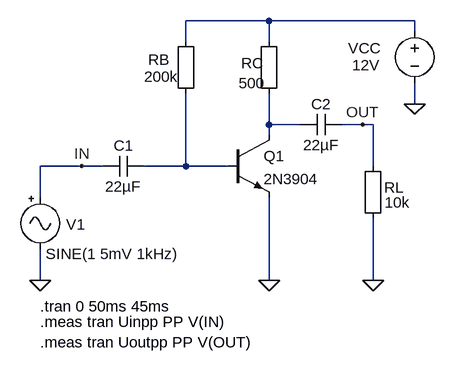
[diagram p0: schematic BT-CE-AMP-1.asc]
BT-CE-AMP-1.asc, the LTspice schematic file:
Version 4
SHEET 1 880 680
WIRE 192 -64 64 -64
WIRE 416 -64 192 -64
WIRE 416 -48 416 -64
WIRE 64 -32 64 -64
WIRE 192 -32 192 -64
WIRE 416 64 416 32
WIRE 192 96 192 48
WIRE 240 96 192 96
WIRE 336 96 304 96
WIRE 352 96 336 96
WIRE 192 112 192 96
WIRE -96 160 -160 160
WIRE -64 160 -96 160
WIRE 64 160 64 48
WIRE 64 160 0 160
WIRE 128 160 64 160
WIRE 352 160 352 96
WIRE -160 208 -160 160
WIRE -160 336 -160 288
WIRE 192 336 192 208
WIRE 352 336 352 240
FLAG 192 336 0
FLAG -160 336 0
FLAG 416 64 0
FLAG -96 160 IN
FLAG 336 96 OUT
FLAG 352 336 0
SYMBOL npn 128 112 R0
SYMATTR InstName Q1
SYMATTR Value 2N3904
SYMBOL Misc\\EuropeanResistor 48 -48 R0
WINDOW 0 -42 44 Left 2
WINDOW 3 -48 70 Left 2
SYMATTR InstName RB
SYMATTR Value 200k
SYMBOL Misc\\EuropeanResistor 176 -48 R0
WINDOW 0 -27 49 Left 2
WINDOW 3 -31 80 Left 2
SYMATTR InstName RC
SYMATTR Value 500
SYMBOL Misc\\signal -160 192 R0
WINDOW 123 0 0 Left 2
WINDOW 0 40 58 Left 2
WINDOW 3 8 103 Left 2
WINDOW 39 0 0 Left 0
SYMATTR InstName V1
SYMATTR Value SINE(1 5mV 1kHz)
SYMBOL voltage 416 -64 R0
WINDOW 0 -102 42 Left 2
WINDOW 3 -96 68 Left 2
WINDOW 123 0 0 Left 2
WINDOW 39 0 0 Left 2
SYMATTR InstName VCC
SYMATTR Value 12V
SYMBOL cap 0 144 R90
WINDOW 0 0 32 VBottom 2
WINDOW 3 32 32 VTop 2
SYMATTR InstName C1
SYMATTR Value 22µF
SYMBOL cap 304 80 R90
WINDOW 0 0 32 VBottom 2
WINDOW 3 32 32 VTop 2
SYMATTR InstName C2
SYMATTR Value 22µF
SYMBOL Misc\\EuropeanResistor 336 144 R0
WINDOW 0 33 49 Left 2
WINDOW 3 34 72 Left 2
SYMATTR InstName RL
SYMATTR Value 10k
TEXT -160 376 Left 2 !.tran 0 50ms 45ms
TEXT -160 400 Left 2 !.meas tran Uinpp PP V(IN)\n.meas tran Uoutpp PP V(OUT)

The netlist it stands for:
* BT-CE-AMP-1.asc
Q1 N002 N003 0 0 2N3904
RB N001 N003 200k
RC N001 N002 500
V1 IN 0 SINE(1 5mV 1kHz)
VCC N001 0 12V
C1 N003 IN 22µF
C2 OUT N002 22µF
RL OUT 0 10k
.model NPN NPN
.model PNP PNP
.lib standard.bjt
.tran 0 50ms 45ms
.meas tran Uinpp PP V(IN)
.meas tran Uoutpp PP V(OUT)
.backanno
.end